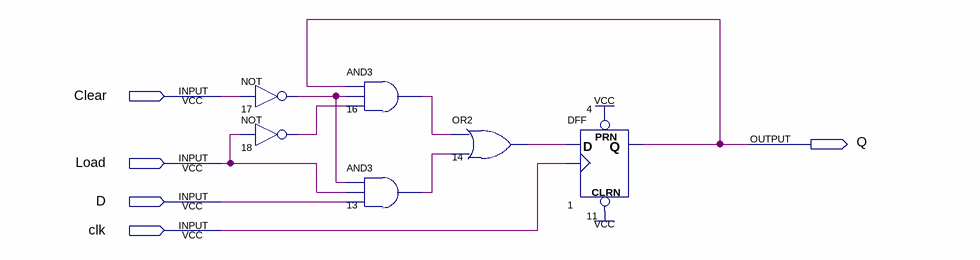
[diagram p0: schematic sheet]
// Quartus schematic register1bit.bdf as structural Verilog: 6 symbols, 5 pins
module register1bit (
  input  Clear,
  input  Load,
  input  D,
  input  clk,
  output Q
);

  wire n13_out, n14_out, n16_out, n17_out, n18_out;

  not u_17 (n17_out, Clear);
  not u_18 (n18_out, Load);
  and u_16 (n16_out, Q, n17_out, n18_out);
  and u_13 (n13_out, n17_out, Load, D);
  or u_14 (n14_out, n16_out, n13_out);
  DFF u_1 (.CLRN(1'b1), .CLK(clk), .D(n14_out), .PRN(1'b1), .Q(Q));
endmodule
